# Altium schematic sheet MCU_1.SchDoc
size A4; SheetNumber: 7; SheetTotal: 7
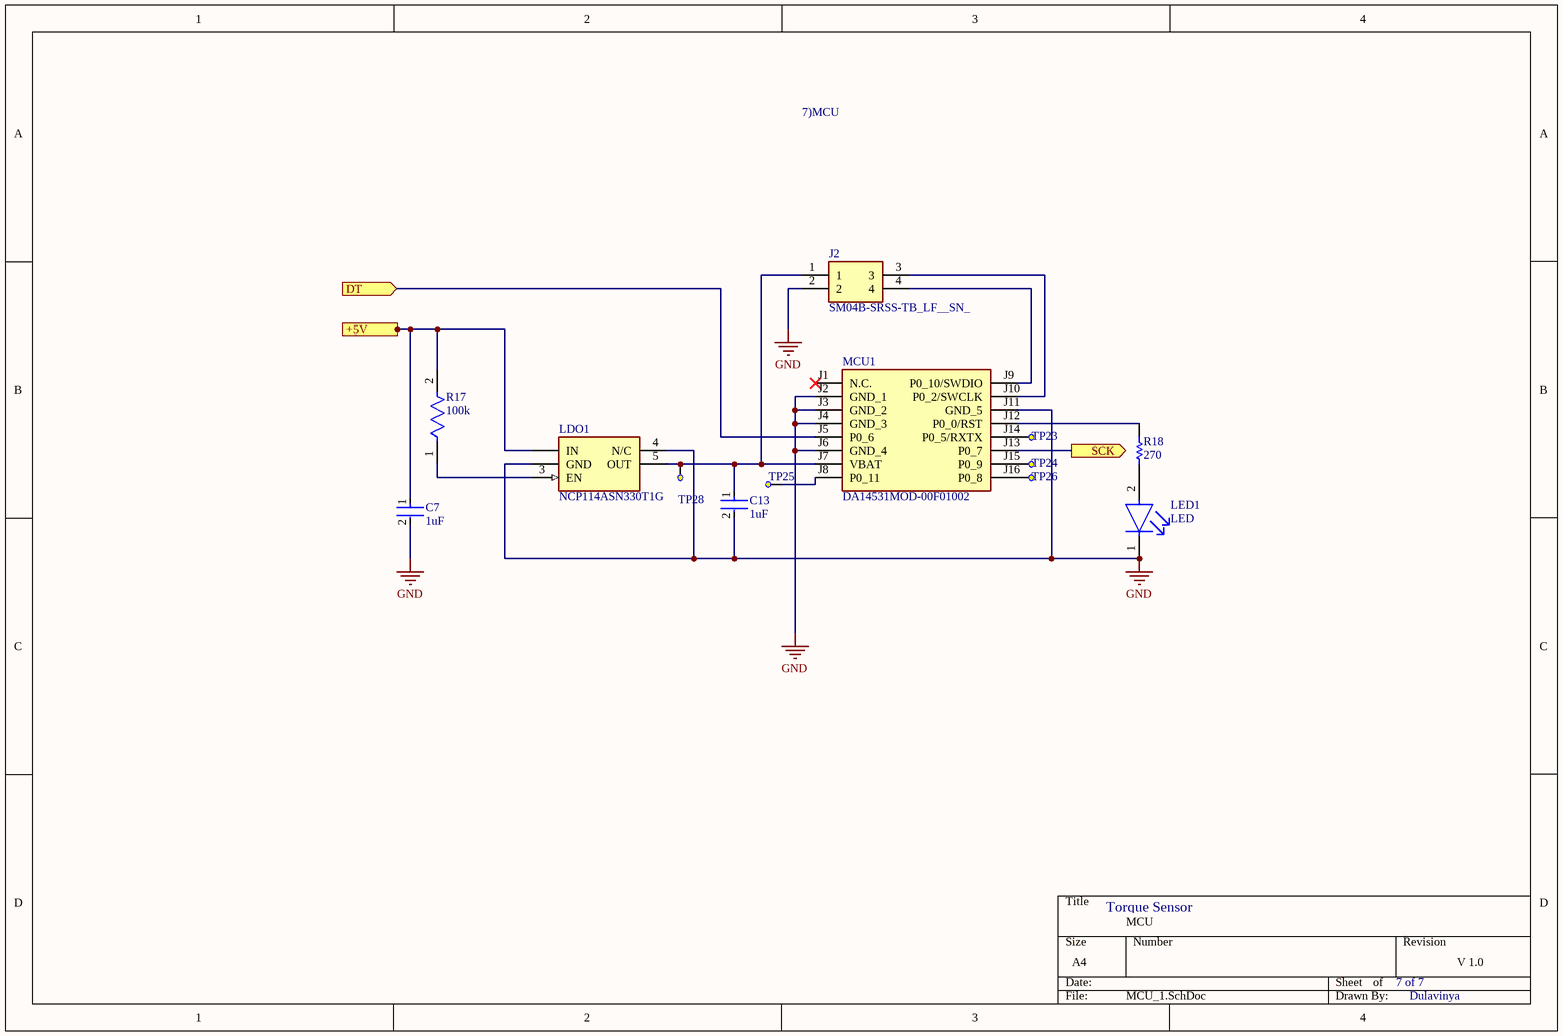
[diagram p0: MCU_1.SchDoc]

## Parts
C7  1uF  [FP-C0402C105K8PACTU-MFG]
C13  1uF  [FP-C0402C105K8PACTU-MFG]
J2  SM04B-SRSS-TB_LF__SN_  [SM04B-SRSS-TB(LFSN)]
LDO1  NCP114ASN330T1G  [SOT95P275X110-5N]
LED1  LED  [FP-APHHS1005CGCK-MFG]
MCU1  DA14531MOD-00F01002  [DA14531MOD00F01002]
R17  100k  [FP-ERJ2RK-IPC_C]
R18  270  [RESC1005X40X25ML05T05]
TP23  Test point  [Test_point]  (value not drawn)
TP24  Test point  [Test_point]  (value not drawn)
TP25  Test point  [Test_point]  (value not drawn)
TP26  Test point  [Test_point]  (value not drawn)
TP28  Test point  [Test_point]  (value not drawn)

## Ports
+5V (in, see H[4C], booster_Circuit[4B], Instrumentation_Amp[2B], Offset[2B]), DT (in, see H[4C], ADC[3B]), SCK (out, see H[4C], ADC[3B])

## Nets
GND: C7.2 C13.2 J2.2 LDO1.2(GND) LDO1.4(N/C) LED1.1(C) MCU1.J2(GND_1) MCU1.J3(GND_2) MCU1.J4(GND_3) MCU1.J6(GND_4) MCU1.J11(GND_5)
+5V: C7.1 LDO1.1(IN) R17.2 ; port +5V
DT: MCU1.J5(P0_6) ; port DT
SCK: MCU1.J13(P0_7) ; port SCK
NetC13_1: C13.1 J2.1 LDO1.5(OUT) MCU1.J7(VBAT) TP28.TP?(Test_point)
NetJ2_3: J2.3 MCU1.J10(P0_2/SWCLK)
NetJ2_4: J2.4 MCU1.J9(P0_10/SWDIO)
NetLDO1_3: LDO1.3(EN) R17.1
NetLED1_2: LED1.2(A) R18.2
NetMCU1_J8: MCU1.J8(P0_11) TP25.TP?(Test_point)
NetMCU1_J12: MCU1.J12(P0_0/RST) R18.1
NetMCU1_J14: MCU1.J14(P0_5/RXTX) TP23.TP?(Test_point)
NetMCU1_J15: MCU1.J15(P0_9) TP24.TP?(Test_point)
NetMCU1_J16: MCU1.J16(P0_8) TP26.TP?(Test_point)

Not connected (* = marked no-connect by the designer): MCU1 J1(N.C.)*

## Notes on the sheet
- 7)MCU
- Torque Sensor
- MCU
- 7 of 7
- V 1.0
- Dulavinya

## Library data of the parts
C7 C13 = CMP-2008-02081-2: CAP CER 1UF 10V X5R 0402; Dielectric Material: Ceramic; Dissipation Factor: 5%; Tolerance: 10%; Number of Pins: 2; Contact Plating: Tin; Min Operating Temperature: -55°C; Termination: SMD/SMT; Lead Free: Lead Free; Construction: Flat; Voltage Rating (DC): 10V; Mount: Surface Mount; Series: C; Thickness: 0.022inch; Width: 0.5mm; Radiation Hardening: No; Capacitance: 1uF; Dielectric: X5R; Height: 0.5mm; Voltage: 10V; Length: 1mm; Depth: 0.5mm; Max Operating Temperature: 85°C; Package Quantity: 1; Packaging: Tape and Reel; RoHS Compliant: Yes; Case Code (Imperial): 0402; Case Code (Metric): 1005; REACH SVHC: No SVHC; Voltage Rating: 10V; Case/Package: 0402
J2 = SM04B-SRSS-TB_LF__SN_: Connector; Manufacturer_Name: JST (JAPAN SOLDERLESS TERMINALS); Manufacturer_Part_Number: SM04B-SRSS-TB(LF)(SN); Datasheet Link: http://www.jst-mfg.com/product/pdf/eng/eSH.pdf; Mouser Part Number: 306-SM04BSRSSTBLFSN; Mouser Price/Stock: https://www.mouser.co.uk/ProductDetail/JST-Commercial/SM04B-SRSS-TBLFSN?qs=cdbOS8ANM9B3FdyA6cNU2A%3D%3D; Arrow Part Number: SM04B-SRSS-TB(LF)(SN); Arrow Price/Stock: https://www.arrow.com/en/products/sm04b-srss-tb-lf-sn/jst-manufacturing?utm_currency=USD&region=europe
LDO1 = NCP114ASN330T1G: Power Supply; Manufacturer_Name: onsemi; Datasheet Link: https://www.onsemi.com/pub/Collateral/NCP114-D.PDF; Height: 1.1mm; Manufacturer_Part_Number: NCP114ASN330T1G; Mouser Part Number: 863-NCP114ASN330T1G; Mouser Price/Stock: https://www.mouser.co.uk/ProductDetail/onsemi/NCP114ASN330T1G?qs=OycAS1CGnljPBnaqdh%252BGIA%3D%3D; Arrow Part Number: NCP114ASN330T1G; Arrow Price/Stock: https://www.arrow.com/en/products/ncp114asn330t1g/on-semiconductor?utm_currency=USD&region=europe
LED1 = CMP-44529-000044-1: LED GREEN CLEAR CHIP SMD; Viewing Angle: 120°; Dominant Wavelength: 570nm; Test Current: 20mA; Luminous Intensity: 50mcd; Forward Voltage: 2.1V; Number of LEDs: 1; Lens Color: Clear; Packaging: Tape and Reel; Max Operating Temperature: 85°C; Illumination Color: Green; Length: 1mm; Mount: Surface Mount; Lens Style: Clear; Color: Green; Number of Pins: 2; Wavelength: 570nm; Case/Package: 0402; Width: 0.5mm; Package Quantity: 2000; Case Code (Metric): 1005; Height: 0.6mm; Lead Free: Lead Free; Case Code (Imperial): 0402; Forward Current: 20mA; Min Operating Temperature: -40°C
MCU1 = DA14531MOD-00F01002: Integrated Circuit; Manufacturer_Name: Renesas Electronics; Datasheet Link: https://www.dialog-semiconductor.com/sites/default/files/2020-12/da14531mod_datasheet_v2.3.pdf; Height: 3.05mm; Manufacturer_Part_Number: DA14531MOD-00F01002; Mouser Part Number: 724-DA14531MODF01002; Mouser Price/Stock: https://www.mouser.co.uk/ProductDetail/Renesas-Dialog/DA14531MOD-00F01002?qs=vmHwEFxEFR%2FOK5Vt%252Bf%2FdqA%3D%3D
R17 = CMP-2002-00608-4: RES SMD 100K OHM 1% 1/10W 0402; Resistance: 100kR; Voltage Rating (DC): 50V; Power Rating: 100mW; Temperature Coefficient: 100ppm/°C; Case/Package: 0402; Length: 1mm; Package Quantity: 1; Radiation Hardening: No; Case Code (Metric): 1005; Contact Plating: Tin; Mount: Surface Mount; Depth: 0.5mm; Max Operating Temperature: 155°C; Lead Free: Lead Free; Width: 0.5mm; Composition: Thick Film; Case Code (Imperial): 0402; Tolerance: 1%; Termination: SMD/SMT; Number of Pins: 2; Height: 0.35mm; Voltage Rating: 50V; Military Standard: Not; REACH SVHC: No SVHC; Packaging: Tape and Reel; Min Operating Temperature: -55°C; Max Power Dissipation: 100mW; Features: Automotive AEC-Q200; Number of Terminations: 2
R18 = CMP-2002-08427-1: Part Number: CRCW0402270RFKED; Manufacturer: Vishay Dale
TP23-TP26 TP28 = test_point: Value: Test point